# EAGLE design ILARIA_v7 (EAGLE 7.7.0)
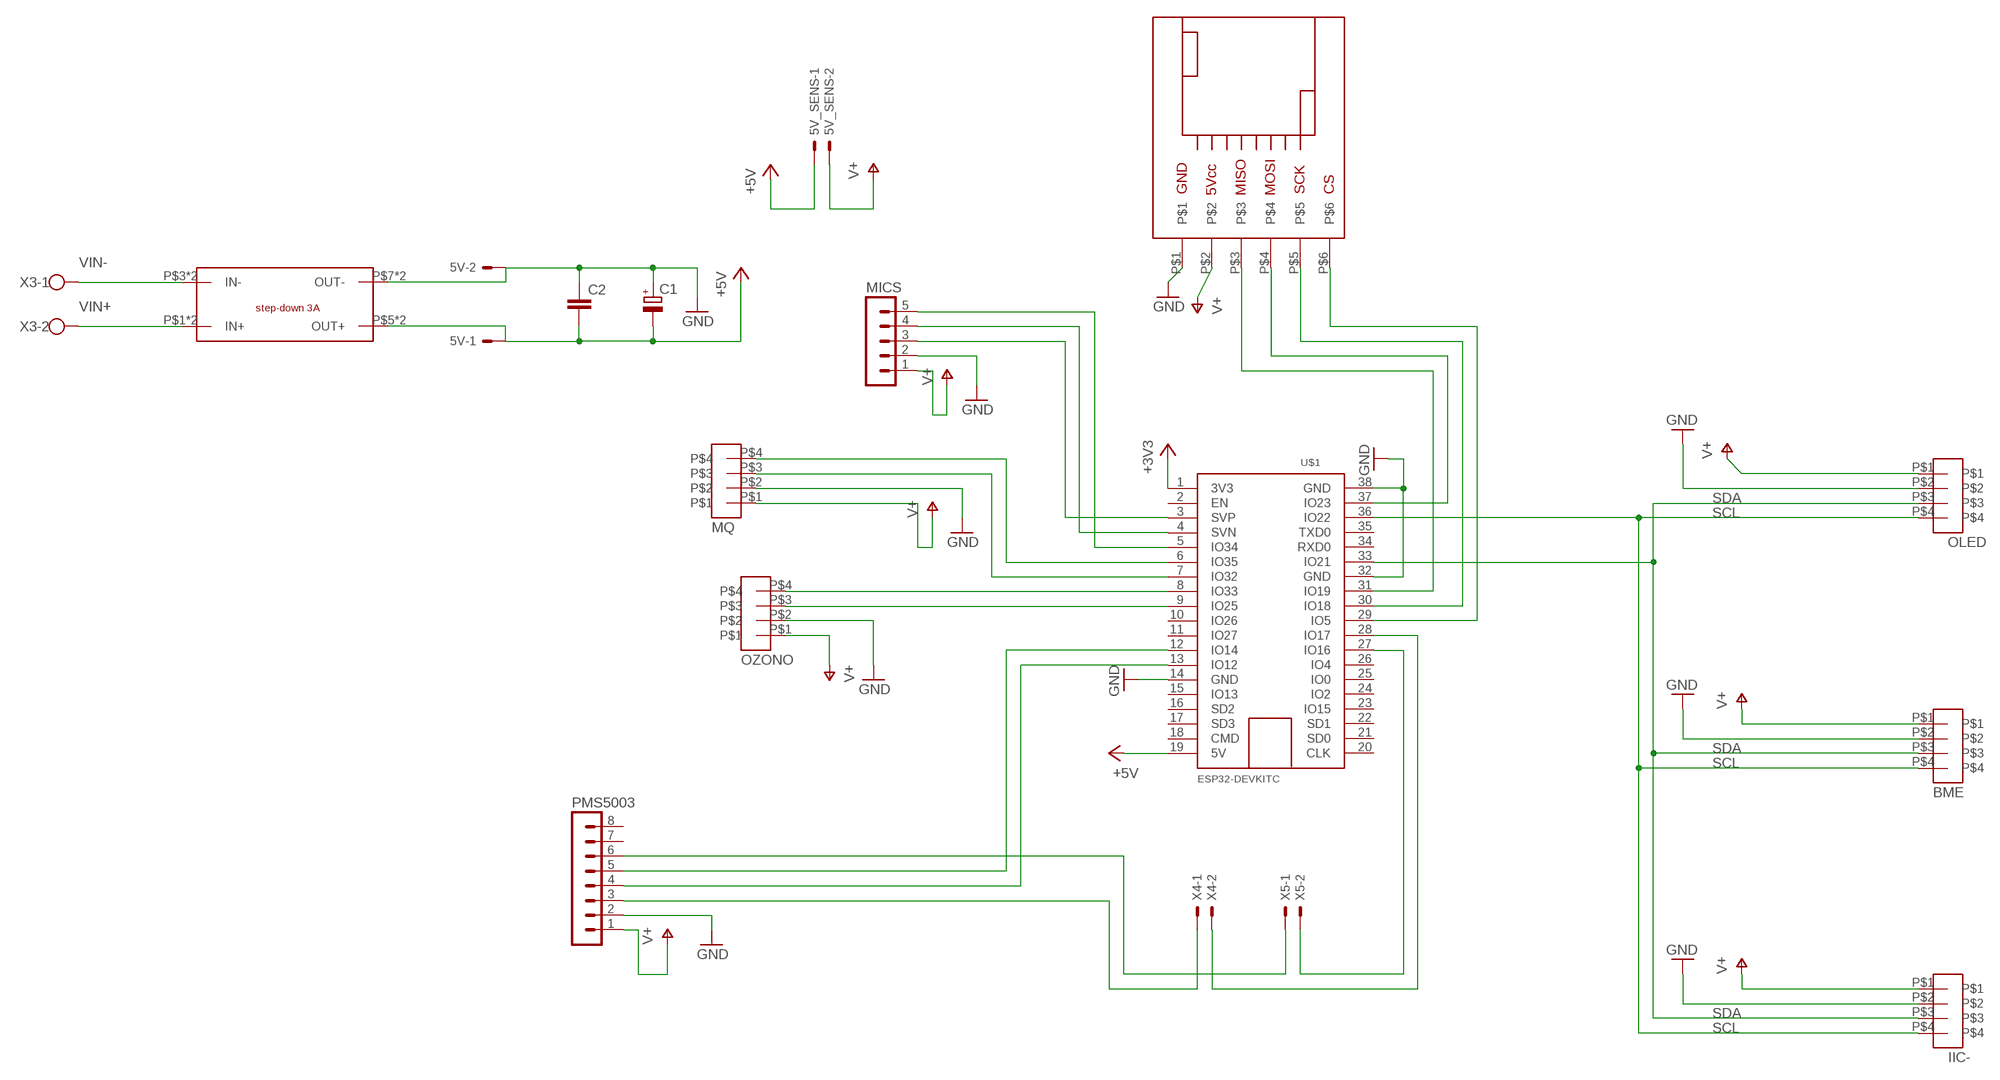
[diagram p0: schematic, sheet 1]

## Parts
5V  22-27-2021-02  [6410-02]
5V_SENS  22-23-2021  [22-23-2021]
AN-1  JST_4PIN_20  [JST_4PIN_20]
C1  CPOL-EUE2.5-7  [E2,5-7]
C2  C-EU050-025X075  [C050-025X075]
MICS  MA05-1  [MA05-1]
OLED  OLED  JST_4PIN_20  [JST_4PIN_20]
PMS5003  MA08-1  [MA08-1]
U$1  ESP32DEVKITC  [ESP32-DEVKITC]
U$2  USD_CARD  [USDCARD_BOARD]
U$3  STEP_DOWN  [STEP_DOWN_MODULE]
U$4  JST_4PIN_20  [JST_4PIN_20]
U$5  JST_4PIN_20  [JST_4PIN_20]
U$6  JST_4PIN_20  [JST_4PIN_20]
X3  W237-102  [W237-102]
X4  87758-0216  [87758-0216]
X5  87758-0216  [87758-0216]

## Nets
+3V3: U$1.1(3V3)
+5V: 5V.1 5V_SENS.1 C1.- C2.2 U$1.19(5V) U$3.P$5(OUT+) U$3.P$6(OUT+)
GND: 5V.2 AN-1.P$2 C1.+ C2.1 MICS.2 OLED.P$2 PMS5003.2 U$1.14(GND) U$1.32(GND) U$1.38(GND) U$2.P$1 U$3.P$7(OUT-) U$3.P$8(OUT-) U$4.P$2 U$5.P$2 U$6.P$2
N$3: U$1.31(IO19) U$2.P$3
N$4: U$1.37(IO23) U$2.P$4
N$5: U$1.30(IO18) U$2.P$5
N$6: U$1.29(IO5) U$2.P$6
N$11: MICS.4 U$1.4(SVN)
N$12: MICS.3 U$1.3(SVP)
N$13: MICS.5 U$1.5(IO34)
N$14: U$1.7(IO32) U$4.P$3
N$15: U$1.6(IO35) U$4.P$4
N$16: PMS5003.5 U$1.12(IO14)
N$17: PMS5003.4 U$1.13(IO12)
N$20: PMS5003.3 X4.1
N$21: U$1.28(IO17) X4.2
N$22: U$1.27(IO16) X5.2
N$23: PMS5003.6 X5.1
SCL: AN-1.P$4 OLED.P$4 U$1.36(IO22) U$5.P$4 U$6.P$4
SDA: AN-1.P$3 OLED.P$3 U$1.33(IO21) U$5.P$3 U$6.P$3
V+: 5V_SENS.2 AN-1.P$1 MICS.1 OLED.P$1 PMS5003.1 U$2.P$2 U$4.P$1 U$5.P$1 U$6.P$1
VIN+: U$3.P$1(IN+) U$3.P$2(IN+) X3.2
VIN-: U$3.P$3(IN-) U$3.P$4(IN-) X3.1
Unconnected: PMS5003.7 PMS5003.8 U$1.2(EN) U$1.8(IO33) U$1.9(IO25) U$1.10(IO26) U$1.11(IO27) U$1.15(IO13) U$1.16(SD2) U$1.17(SD3) U$1.18(CMD) U$1.20(CLK) U$1.21(SD0) U$1.22(SD1) U$1.23(IO15) U$1.24(IO2) U$1.25(IO0) U$1.26(IO4) U$1.34(RXD0) U$1.35(TXD0)

## Notes on the sheet
- MQ
- OLED
- OZONO
- BME
- IIC-

## Library data of the parts
5V = con-molex:22-?-02: CONNECTOR wire to board 2.54 mm (.1 inch) pitch header; OC_FARNELL: unknown; OC_NEWARK: unknown
5V_SENS = con-molex:22-23-2021: .100" (2.54mm) Center Header - 2 Pin; MF: MOLEX; MPN: 22-23-2021; OC_FARNELL: 1462926; OC_NEWARK: 25C3832
AN-1 OLED U$4-U$6 = LUCA_VARIE:JST_4PIN_20
C1 = rcl:CPOL-EU: POLARIZED CAPACITOR, European symbol
C2 = rcl:C-EU: CAPACITOR, European symbol
MICS = con-lstb:MA05-1: PIN HEADER; OC_FARNELL: unknown; OC_NEWARK: unknown
PMS5003 = con-lstb:MA08-1: PIN HEADER; OC_FARNELL: unknown; OC_NEWARK: unknown
U$1 = ESP32-DEVKITC:ESP32DEVKITC
U$2 = LUCA_VARIE:USD_CARD
U$3 = LUCA_vari:STEP_DOWN
X3 = con-wago-500:W237-102: WAGO SCREW CLAMP; MPN: 237-102; OC_FARNELL: unknown; OC_NEWARK: 70K9898
X4 X5 = con-molex:87758-0216: 2 Pin - 2mm Dual Row Single Wafer, Vertical T/H HDR Source: http://www.molex.com/pdm_docs/sd/877580616_sd.pdf; MPN: 87758-0216; OC_FARNELL: unknown; OC_NEWARK: 94M1513

## Board
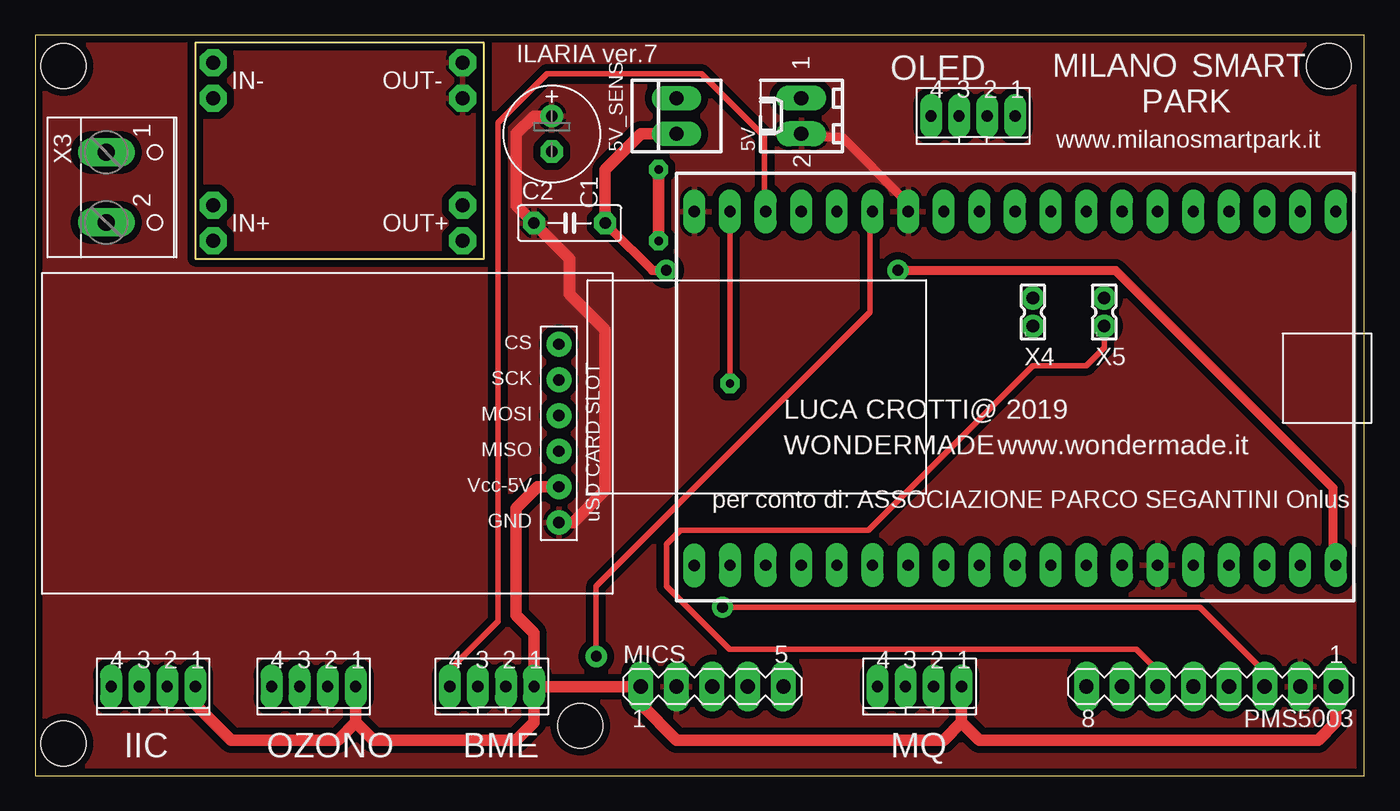
[diagram p1: board, top side]
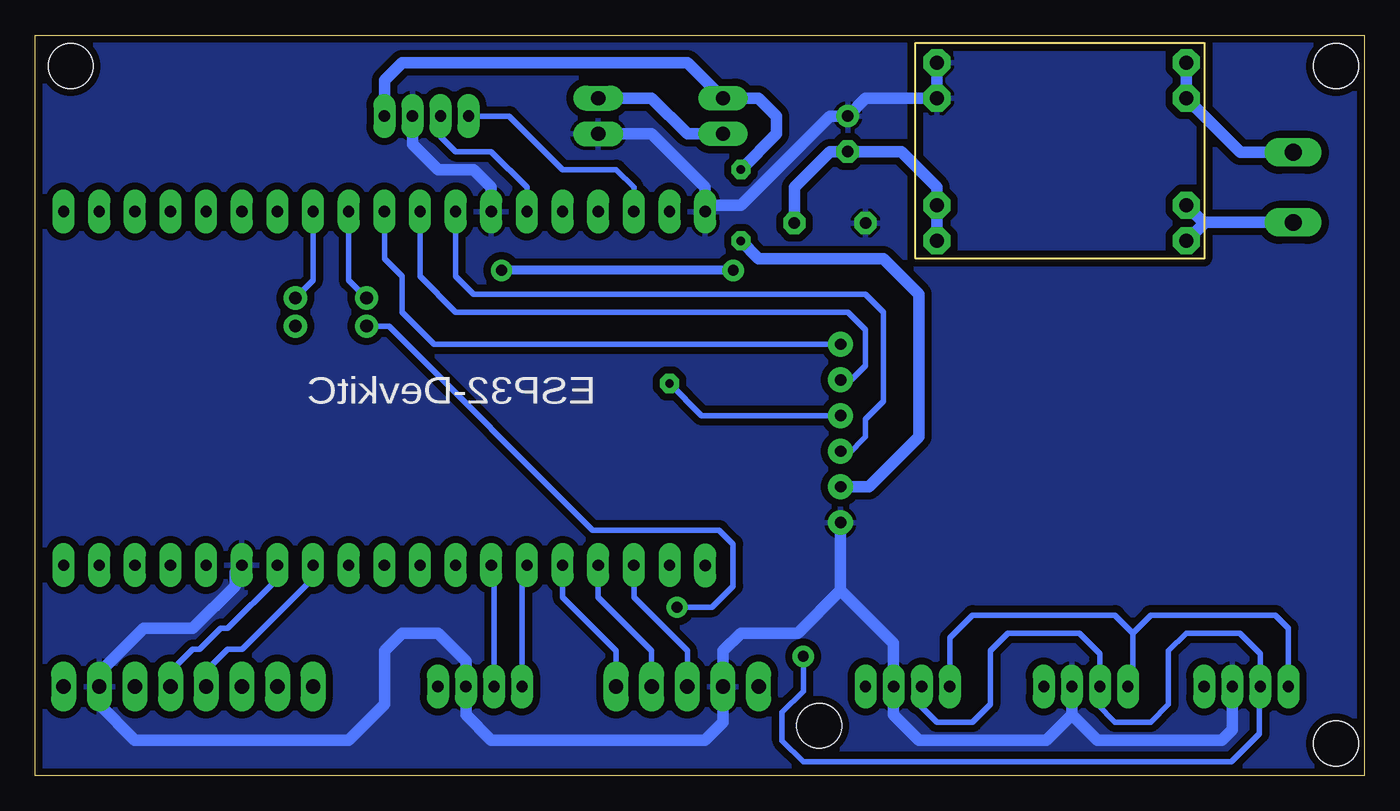
[diagram p2: board, bottom side, seen from below]

Size 94.73 x 52.76 mm. Coordinates in mm from the lower left corner, seen from the top.
Outline: 94.73,0 94.73,52.76 0,52.76 0,0 94.73,0
Copper layers (1*16): Top 0.035mm / dielectric 1.6mm / Bottom 0.035mm
Design rules "default *": minimum track width 25mil, minimum drill 30mil, track to track 20mil, track to pad 20mil, pad to pad 20mil, via to via 20mil, smd to smd 20mil, copper to edge 20mil, drill to drill 20mil, minimum pad ring 15mil, minimum via ring 15mil, stop-mask expansion 8mil, vias tented up to drill 0mil, thermal gap 10mil
Holes 3.2 mm at 2.02,2.29 2.02,50.55 38.85,3.56 92.19,50.55

### Footprints (pad centres in the part's own frame; a part is rotated, then mirrored left to right if it is on the bottom)
6410-02 = drill 1.016 long: 1 1.27,0; 2 -1.27,0
22-23-2021 = drill 1 long: 1 -1.27,0; 2 1.27,0
JST_4PIN_20 = drill 0.8 long: P$1 0,0; P$2 2,0; P$3 4,0; P$4 6,0
E2,5-7 = drill 0.813 pad 1.6: + -1.27,0 | drill 0.813 pad 1.6 octagon: - 1.27,0
C050-025X075 = drill 0.813 octagon: 1 -2.54,0; 2 2.54,0
MA05-1 = drill 1.016 long: 1 -5.08,0; 2 -2.54,0; 3 0,0; 4 2.54,0; 5 5.08,0
MA08-1 = drill 1.016 long: 1 -8.89,0; 2 -6.35,0; 3 -3.81,0; 4 -1.27,0; 5 1.27,0; 6 3.81,0; 7 6.35,0; 8 8.89,0
ESP32-DEVKITC = drill 0.8 pad 1.422 long: 1 -44.46,-13.98; 2 -41.92,-13.96; 3 -39.38,-13.96; 4 -36.84,-13.96; 5 -34.3,-13.96; 6 -31.76,-13.96; 7 -29.22,-13.96; 8 -26.68,-13.96; 9 -24.14,-13.96; 10 -21.6,-13.96; 11 -19.06,-13.96; 12 -16.52,-13.96; 13 -13.98,-13.96; 14 -11.44,-13.96; 15 -8.9,-13.96; 16 -6.36,-13.96; 17 -3.82,-13.96; 18 -1.28,-13.96; 19 1.26,-13.96; 20 1.26,11.23; 21 -1.28,11.23; 22 -3.82,11.23; 23 -6.36,11.23; 24 -8.9,11.23; 25 -11.44,11.23; 26 -13.98,11.23; 27 -16.52,11.23; 28 -19.06,11.23; 29 -21.6,11.23; 30 -24.14,11.23; 31 -26.68,11.23; 32 -29.22,11.23; 33 -31.76,11.23; 34 -34.3,11.23; 35 -36.84,11.23; 36 -39.38,11.23; 37 -41.92,11.23; 38 -44.46,11.23
USDCARD_BOARD = drill 0.8 pad 1.778: P$1 3.81,17.78; P$2 3.81,15.24; P$3 3.81,12.7; P$4 3.81,10.16; P$5 3.81,7.62; P$6 3.81,5.08
STEP_DOWN_MODULE = drill 1 pad 1.93 octagon: P$1 1.27,1.27; P$2 1.27,3.81; P$3 1.27,11.43; P$4 1.27,13.97; P$5 19.05,1.27; P$6 19.05,3.81; P$7 19.05,11.43; P$8 19.05,13.97
W237-102 = drill 1.194 long: 1 -2.5,-1.27; 2 2.5,-1.27
87758-0216 = drill 0.9 pad 1.27: 1 0,-1; 2 0,1

### Placement (x,y rotation side)
5V  54.6,46.99 90 top
5V_SENS  45.71,46.99 90 top
AN-1  22.85,6.35 180 top
C1  36.82,45.72 270 top
C2  38.09,39.37 0 top
MICS  48.25,6.35 0 top
OLED  69.84,46.99 180 top
PMS5003  83.81,6.35 180 top
U$1  91.44,28.96 0 top
U$2  41.14,35.81 180 top
U$3  11.42,36.83 0 top
U$4  66.03,6.35 180 top
U$5  11.42,6.35 180 top
U$6  35.55,6.35 180 top
X3  6.34,41.91 270 top
X4  71.11,33.02 0 top
X5  76.19,33.02 0 top

### Tracks (layer width: path | path; a pad name or v marks a point on that pad's centre or on a via)
+5V  (via drill 0.76)
  Top 0.635: v61.49,36 76.99,36 92.49,20.5 92.49,15 U$1.19 | v44.99,36 43.99,36 40.99,39 C2.2
  Top 0.813: C2.2 40.63,43.18 43.17,45.72 5V_SENS.1
  Bottom 0.635: v44.99,36 v61.49,36
  Bottom 0.813: U$3.P$5 U$3.P$6 30.47,41.91 33.01,44.45 C1.- 38.09,44.45 40.63,41.91 C2.2 | 5V.1 50.79,48.26 48.25,45.72 5V_SENS.1
GND
  Top 0.635: U$1.32 61.99,40.5 61.99,41 57.49,45.5 54.99,45.5 5V.2
  Top 0.813: C1.+ 35.55,46.99 34.28,45.72 34.28,40.64 C2.1 38.09,36.83 38.09,34.29 40.63,31.75 40.63,20.32 38.34,18.03 U$2.P$1
  Bottom 0.635: 89.99,7.5 89.99,6.5 PMS5003.2
  Bottom 0.813: U$3.P$8 U$3.P$7 35.55,48.26 C1.+ 38.09,46.99 44.44,40.64 46.53,40.64 U$1.38 46.98,41.91 50.79,45.72 5V.2 | OLED.P$2 67.84,44.99 66.03,43.18 63.49,43.18 62.22,41.91 U$1.32 | U$5.P$2 9.42,3.27 10.15,2.54 19.04,2.54 20.85,4.35 | 20.85,4.35 AN-1.P$2 | 20.85,4.35 22.66,2.54 31.74,2.54 33.55,4.35 U$6.P$2 33.55,9.43 37.33,13.21 | U$2.P$1 37.33,13.21 | PMS5003.2 90.16,5.08 87.62,2.54 72.38,2.54 69.84,5.08 69.84,8.89 68.57,10.16 66.03,10.16 64.03,8.16 U$4.P$2 64.03,4.35 62.22,2.54 46.98,2.54 45.71,3.81 MICS.2 45.71,8.89 44.44,10.16 40.38,10.16 37.33,13.21 | 89.99,7.5 86.99,10.5 83.49,10.5 80.49,13.5 80.49,14.5 U$1.14
  pour Bottom: -0.01,53.34 95.24,53.34 95.24,0 -0.01,0
  pour Top: -0.01,52.07 93.97,52.07 93.97,0 -0.01,0
N$3
  Bottom 0.406: U$1.31 64.76,35.56 63.49,34.29 35.55,34.29 34.28,33.02 34.28,26.67 35.55,25.4 35.55,24.13 36.82,22.86 37.07,22.86 U$2.P$3
N$4  (via drill 0.6)
  Top 0.406: v49.52,27.94 U$1.37
  Bottom 0.406: U$2.P$4 47.23,25.65 v49.52,27.94
N$5
  Bottom 0.406: U$2.P$5 36.57,28.19 35.55,29.21 35.55,31.75 36.82,33.02 64.76,33.02 67.3,35.56 U$1.30
N$6
  Bottom 0.406: U$2.P$6 66.28,30.73 68.57,33.02 68.57,35.56 69.84,36.83 U$1.29
N$11
  Bottom 0.406: MICS.4 50.79,8.89 54.6,12.7 U$1.4
N$12
  Bottom 0.406: U$1.3 52.06,12.7 48.25,8.89 MICS.3
N$13
  Bottom 0.406: MICS.5 53.33,8.89 57.14,12.7 U$1.5
N$14
  Bottom 0.406: U$1.7 62.03,14.81 U$4.P$3
N$15
  Bottom 0.406: U$1.6 60.03,14.65 U$4.P$4
N$16
  Bottom 0.406: 74.99,14.5 74.99,14 79.99,9 80.99,9 82.49,7.5 82.49,6.5
  Bottom 0.635: 74.99,14.5 U$1.12 | 82.49,6.5 PMS5003.5
N$17
  Bottom 0.406: 77.49,14.5 77.49,14 80.99,10.5 81.49,10.5 82.99,9 83.49,9 84.99,7.5 84.99,6.5
  Bottom 0.635: 77.49,14.5 U$1.13 | 84.99,6.5 PMS5003.4
N$20  (via drill 0.76)
  Top 0.406: v48.99,12 82.99,12 87.49,7.5
  Top 0.635: 87.49,7.5 87.49,6.5 PMS5003.3
  Bottom 0.406: 70.99,32 69.49,32 54.99,17.5 45.99,17.5 44.99,16.5 44.99,13.5 46.49,12 v48.99,12
  Bottom 0.635: 70.99,32 X4.1
N$21
  Bottom 0.406: U$1.28 72.38,35.29 X4.2
N$22
  Bottom 0.406: U$1.27 74.92,35.29 X5.2
N$23
  Top 0.406: 79.99,7.5 78.49,9 49.49,9 44.99,13.5 44.99,16.5 45.99,17.5 59.4,17.5 71.11,29.21 74.92,29.21 76.19,30.48 X5.1
  Top 0.635: 79.99,7.5 79.99,6.5 PMS5003.6
SCL
  Top 0.406: 51.99,40.5 51.99,45.5 47.49,50 36.49,50 32.99,46.5 32.99,11 29.49,7.5
  Top 0.635: 29.49,7.5 29.49,6.5 U$6.P$4 | 51.99,40.5 U$1.36
  Bottom 0.406: OLED.P$4 60.95,46.99 57.14,43.18 53.33,43.18 52.06,41.91 U$1.36 | U$5.P$4 5.42,10.51 6.34,11.43 15.23,11.43 16.5,10.16 | 16.5,10.16 16.5,6.7 AN-1.P$4 | U$6.P$4 29.55,9.81 27.93,11.43 17.77,11.43 16.5,10.16
SDA  (via drill 0.76)
  Top 0.406: 59.49,40 59.49,33 39.99,13.5 v39.99,8.5
  Top 0.635: 59.49,40 U$1.33
  Bottom 0.406: OLED.P$3 65.84,45.53 64.76,44.45 62.22,44.45 59.68,41.91 U$1.33 | U$5.P$3 7.42,8.7 8.88,10.16 12.69,10.16 13.96,8.89 13.96,5.08 15.23,3.81 17.77,3.81 19.04,5.08 19.04,6.16 AN-1.P$3 18.85,8.7 20.31,10.16 25.39,10.16 26.66,8.89 26.66,5.08 27.93,3.81 30.47,3.81 31.74,5.08 31.74,6.16 U$6.P$3 | v39.99,8.5 39.99,6 41.49,4.5 41.49,2.5 39.99,1 9.49,1 7.49,3 7.49,6
  Bottom 0.635: 7.49,6 U$5.P$3
V+  (via drill 0.6)
  Top 0.813: U$5.P$1 11.42,5.08 13.96,2.54 21.58,2.54 22.85,3.81 | AN-1.P$1 22.85,3.81 | 22.85,3.81 24.12,2.54 34.28,2.54 35.55,3.81 U$6.P$1 | U$6.P$1 MICS.1 43.17,5.08 45.71,2.54 64.76,2.54 66.03,3.81 | U$2.P$2 35.8,20.57 34.28,19.05 34.28,11.43 35.55,10.16 U$6.P$1 | PMS5003.1 92.7,3.81 91.43,2.54 67.3,2.54 66.03,3.81 | U$4.P$1 66.03,3.81 | v44.44,38.1 v44.44,43.18
  Bottom 0.813: OLED.P$1 69.84,49.53 68.57,50.8 48.25,50.8 5V_SENS.2 43.17,48.26 41.9,46.99 41.9,45.72 v44.44,43.18 | U$2.P$2 35.3,20.57 31.74,24.13 31.74,34.29 34.28,36.83 43.17,36.83 v44.44,38.1
VIN+
  Bottom 0.813: X3.2 11.38,39.41 11.42,39.37 | 11.42,39.37 U$3.P$1 | U$3.P$2 11.42,39.37
VIN-
  Bottom 0.813: X3.1 8.84,44.41 U$3.P$3 U$3.P$4

### Text on the board
tPlace: ILARIA ver.7 | OLED | MILANO | SMART | PARK | www.milanosmartpark.it | LUCA CROTTI@ 2019 | WONDERMADE | www.wondermade.it | per conto di: ASSOCIAZIONE PARCO SEGANTINI Onlus | IIC | OZONO | BME | MQ